# Altium schematic sheet sheet_LAC.SchDoc
size A
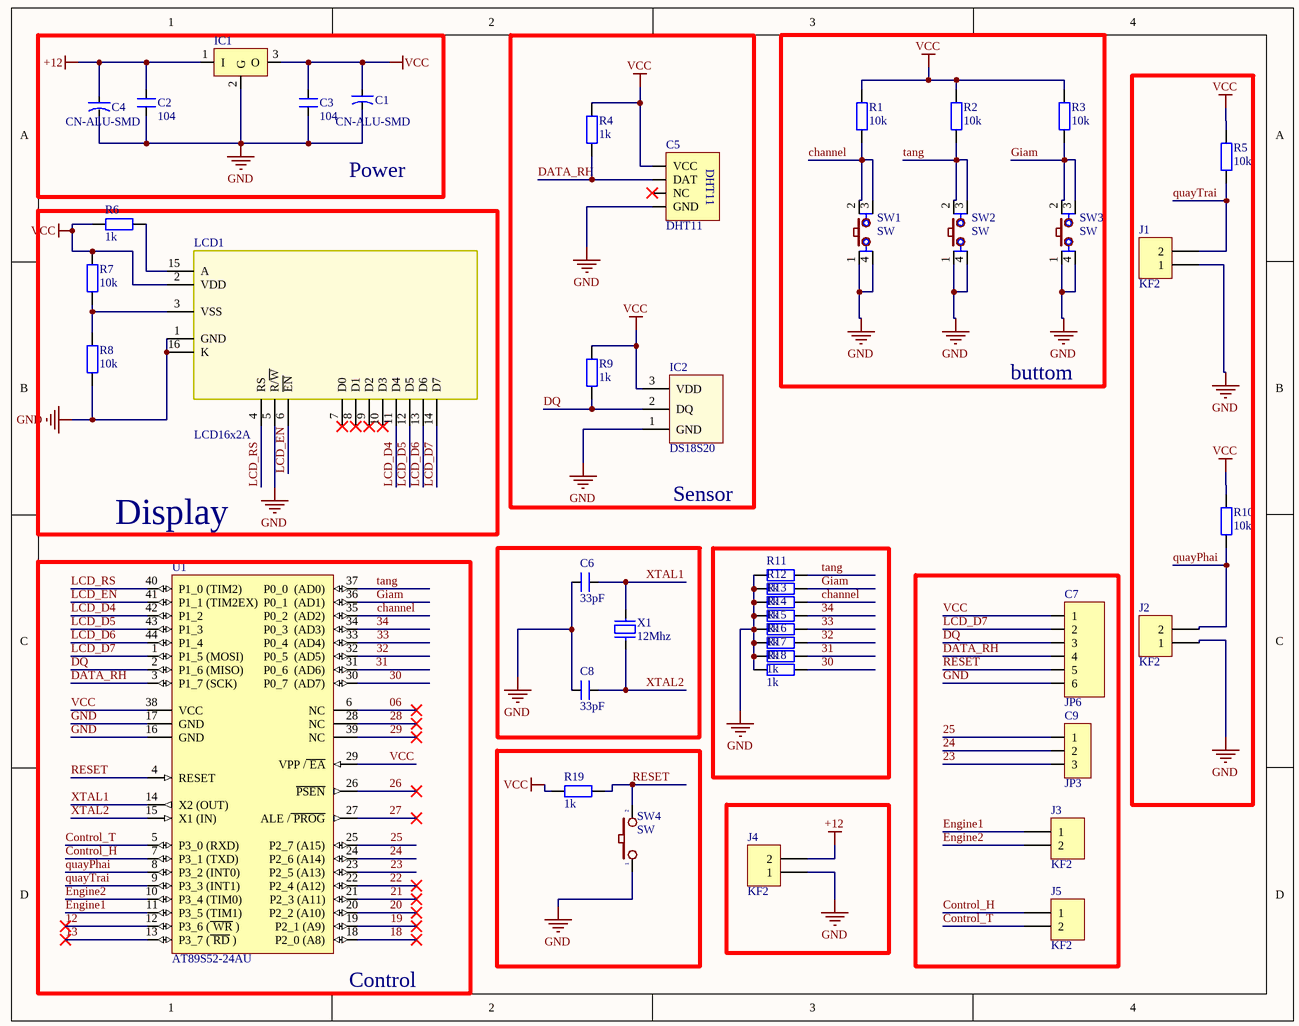
[diagram p0: sheet_LAC.SchDoc]

## Parts
C1  CN-ALU-SMD  [3.2X1.6X1.1]
C2  104  [SM-CAP-0805]
C3  104  [SM-CAP-0805]
C4  CN-ALU-SMD  [3.2X1.6X1.1]
C5  DHT11  [DHT11]
C6  33pF  [6-0805_N]
C7  JP6  [JP6-C1T]
C8  33pF  [6-0805_N]
C9  JP3  [JP3-C1T]
IC1  LM78xx  [TO252-123]  (value not drawn)
IC2  DS18S20  [JP3-C1T]
J1  KF2  [KF2-3.5]
J2  KF2  [KF2-3.5]
J3  KF2  [KF2-3.5]
J4  KF2  [KF2-5.08]
J5  KF2  [KF2-3.5]
LCD1  LCD16x2A  [LCD16X2]
R1  10k  [6-0805_N]
R2  10k  [6-0805_N]
R3  10k  [6-0805_N]
R4  1k  [6-0805_N]
R5  10k  [6-0805_N]
R6  1k  [6-0805_N]
R7  10k  [6-0805_N]
R8  10k  [6-0805_N]
R9  1k  [6-0805_N]
R10  10k  [6-0805_N]
R11  1k  [6-0805_N]
R12  1k  [6-0805_N]
R13  1k  [6-0805_N]
R14  1k  [6-0805_N]
R15  1k  [6-0805_N]
R16  1k  [6-0805_N]
R17  1k  [6-0805_N]
R18  1k  [6-0805_N]
R19  1k  [6-0805_N]
SW1  SW  [SW2-DIP]
SW2  SW  [SW2-DIP]
SW3  SW  [SW2-DIP]
SW4  SW  [SW1-SMD]
U1  AT89S52-24AU  [TQFP44]
X1  12Mhz  [XT2-SMD]

## Blocks framed on the sheet
Power: C1-C4 IC1
Sensor: C5 IC2 R4 R9
buttom: R1-R3 SW1-SW3
Display: LCD1 R6-R8
Control: U1

## Nets
+12: C2.1 C4.1 IC1.1(I) J4.2
GND: C1.2 C2.2 C3.2 C4.2 C5.4(GND) C6.1 C7.6 C8.1 IC1.2(G) IC2.1(GND) J1.1 J2.1 J4.1 LCD1.1(GND) LCD1.5(R/~{W}) LCD1.16(K) R8.2 R11.2 R12.2 R13.2 R14.2 R15.2 R16.2 R17.2 R18.2 SW1.1 SW1.4 SW2.1 SW2.4 SW3.1 SW3.4 SW4.1 U1.16(GND) U1.17(GND)
VCC: C1.1 C3.1 C5.1(VCC) C7.1 IC1.3(O) IC2.3(VDD) LCD1.2(VDD) R1.1 R2.1 R3.1 R4.1 R5.1 R6.1 R7.1 R9.2 R10.1 R19.2 U1.29(VPP_/~{_EA}) U1.38(VCC)
06: U1.6(NC)
12: U1.12(P3_6_(~{_WR}_))
13: U1.13(P3_7_(~{_RD}_))
18: U1.18(P2_0_(A8))
19: U1.19(P2_1_(A9))
20: U1.20(P2_2_(A10))
21: U1.21(P2_3_(A11))
22: U1.22(P2_4_(A12))
23: C9.3 U1.23(P2_5_(A13))
24: C9.2 U1.24(P2_6_(A14))
25: C9.1 U1.25(P2_7_(A15))
26: U1.26(~{PSEN})
27: U1.27(ALE_/~{_PROG})
28: U1.28(NC)
29: U1.39(NC)
30: R18.1 U1.30(P0_7__(AD7))
31: R17.1 U1.31(P0_6__(AD6))
32: R16.1 U1.32(P0_5__(AD5))
33: R15.1 U1.33(P0_4__(AD4))
34: R14.1 U1.34(P0_3__(AD3))
channel: R1.2 R13.1 SW1.2 SW1.3 U1.35(P0_2__(AD2))
Control_H: J5.1 U1.7(P3_1_(TXD))
Control_T: J5.2 U1.5(P3_0_(RXD))
DATA_RH: C5.2(DAT) C7.4 R4.2 U1.3(P1_7_(SCK))
DQ: C7.3 IC2.2(DQ) R9.1 U1.2(P1_6_(MISO))
Engine1: J3.1 U1.11(P3_5_(TIM1))
Engine2: J3.2 U1.10(P3_4_(TIM0))
Giam: R3.2 R12.1 SW3.2 SW3.3 U1.36(P0_1__(AD1))
LCD_D4: LCD1.11(D4) U1.42(P1_2)
LCD_D5: LCD1.12(D5) U1.43(P1_3)
LCD_D6: LCD1.13(D6) U1.44(P1_4)
LCD_D7: C7.2 LCD1.14(D7) U1.1(P1_5_(MOSI))
LCD_EN: LCD1.6(~{EN}) U1.41(P1_1_(TIM2EX))
LCD_RS: LCD1.4(RS) U1.40(P1_0_(TIM2))
quayPhai: J2.2 R10.2 U1.8(P3_2_(INT0))
quayTrai: J1.2 R5.2 U1.9(P3_3_(INT1))
RESET: C7.5 R19.1 SW4.2 U1.4(RESET)
tang: R2.2 R11.1 SW2.2 SW2.3 U1.37(P0_0__(AD0))
XTAL1: C6.2 U1.14(X2_(OUT)) X1.1
XTAL2: C8.2 U1.15(X1_(IN)) X1.2
NetLCD1_3: LCD1.3(VSS) R7.2 R8.1
NetLCD1_15: LCD1.15(A) R6.2

Not connected (* = marked no-connect by the designer): C5 3(NC)*; LCD1 7(D0)* 8(D1)* 9(D2)* 10(D3)*

## Library data of the parts
C1 C4 = CN-ALU-SMD: Polarized Capacitor (Axial); Published: 8-Jun-2000; LatestRevisionDate: 17-Jul-2002; LatestRevisionNote: Re-released for DXP Platform.; PackageReference: POLAR0.8; Publisher: Altium Limited
C2 C3 = CN: Value: 0,1uF/300V; Designed by: VanDungEvn
C5 = DHT11: Manufacturer: W¨¹rth Elektronik eiSos GmbH; partNo: 613004143121; ComponentLink1 Description: Manufacturer; ComponentLink2 Description: Datasheet; NoPins: 04; Created Date: 29 March 2013; ComponentLink1URL: http://www.we-online.com; ComponentLink2URL: http://katalog.we-online.de/em/datasheet/6130xx143121.pdf; Created by: Karrer Zheng
C6 C8 = CN1: Cap np  1pF - 472pF; Value: 100pF
C7 = JP6: WR-PHD 2.54 mm Angled Socket Header; Manufacturer: W¨¹rth Elektronik eiSos GmbH; partNo: 613006143121; ComponentLink1 Description: Manufacturer; ComponentLink2 Description: Datasheet; NoPins: 06; Created Date: 29 March 2013; ComponentLink1URL: http://www.we-online.com; ComponentLink2URL: http://katalog.we-online.de/em/datasheet/6130xx143121.pdf; Created by: Karrer Zheng
C9 = JP3: WR-PHD 2.54 mm Angled Socket Header; Manufacturer: W¨¹rth Elektronik eiSos GmbH; partNo: 613003143121; ComponentLink1 Description: Manufacturer; ComponentLink2 Description: Datasheet; NoPins: 03; Created Date: 29 March 2013; ComponentLink1URL: http://www.we-online.com; ComponentLink2URL: http://katalog.we-online.de/em/datasheet/6130xx143121.pdf; Created by: Karrer Zheng
IC1 = LM78xx: Positive Voltage Regulator; Note: Tab is connected to pin 3 (GND).; Published: 24-Aug-2001; LatestRevisionDate: 17-Jul-2002; LatestRevisionNote: Re-released for DXP Platform.; DatasheetVersion: Apr-1994; PackageVersion: Jul-1998; PackageReference: ISOWATT220AB; Publisher: Altium Limited; PackageDescription: TO, Thru-Hole, Vertical, Heatsink Mounted; 3 In-Line Leads; Pitch 2.54 mm; Pin sequence 1, 3, 2; ComponentLink1Description: Manufacturer Link; ComponentLink1URL: http://www.st.com/; ComponentLink2Description: Datasheet; ComponentLink2URL: http://www.st.com/stonline/products/literature/ds/2146/l78m05c.pdf
IC2 = DS18S20: High Precision  1-Wire® Digital Thermometer
J1-J5 = KF2: Manufacturer: Würth Elektronik eiSos GmbH; partNo: 691103110002; ComponentLink1 Description: Manufacturer; ComponentLink2 Description: Datasheet; NoPins: 2; Created Date: 29 October 2013; ComponentLink1URL: http://www.we-online.com; ComponentLink2URL: http://katalog.we-online.de/em/datasheet/6911031100xx.pdf; Created by: Karrer Zheng
LCD1 = LCD16x2: LCD dipslay 16 char, 2 line; Value: LCD16x2A
R1-R19 = R1/4W: Resistor 1/4W; Value: R1/4W - 1K
SW1-SW3 = SW4: Switch button 4 pin; Value: Button chip 4 pin
SW4 = SW2: Switch button 2 pin; Value: SW chip 2 pin
U1 = AT89S52-24AU: Atmel 8 Bit Micro 4.0-5.5V 24MHz -40 to +80 Deg C 44TQFP (44A) Package GREEN OPTION; GREEN OPTION: YES; Vendor: ATMEL; PartNr: AT89S52-24AU; Package: 44A 44-lead, Thin Plastic Gull Wing Quad Flatpack (TQFP)
X1 = XT2: Crystal, 32.768 KHz, -40 to 85 degC, 3.2 x 1.5 x 0.9 mm SMD; Value: 4Mhz